# Altium schematic sheet Top.SchDoc: TRACE TRACK
size A4; Author: YZ
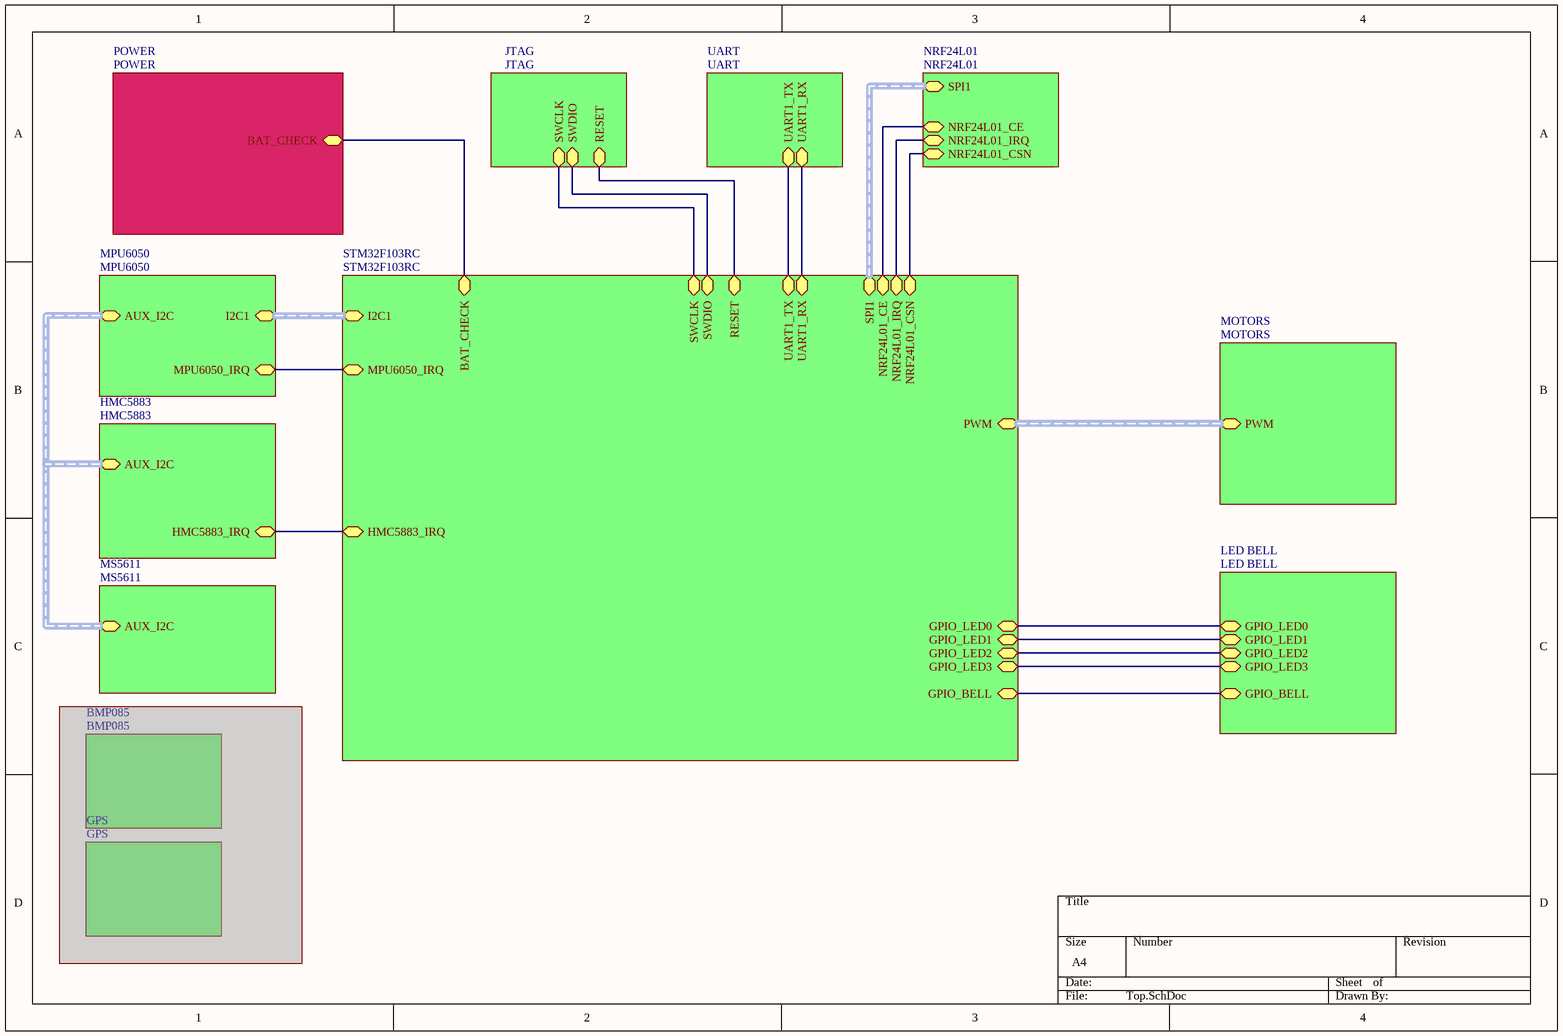
[diagram p0: Top.SchDoc]

## Sub-sheets
BMP085 = BMP085 (masked out): no entries
GPS = GPS (masked out): no entries
HMC5883 = HMC5883: AUX_I2C (harness AUX_I2C), HMC5883_IRQ
JTAG = JTAG: SWCLK, SWDIO, RESET
LED BELL = LED BELL: GPIO_LED1, GPIO_LED0, GPIO_BELL, GPIO_LED3, GPIO_LED2
MOTORS = MOTORS: PWM (harness PWM)
MPU6050 = MPU6050: MPU6050_IRQ, I2C1 (harness I2C1), AUX_I2C (harness AUX_I2C)
MS5611 = MS5611: AUX_I2C (harness AUX_I2C)
NRF24L01 = NRF24L01: SPI1 (harness SPI1), NRF24L01_IRQ, NRF24L01_CSN, NRF24L01_CE
POWER = POWER: BAT_CHECK
STM32F103RC = STM32F103RC: UART1_TX, UART1_RX, SWCLK, RESET, SWDIO, GPIO_BELL, GPIO_LED0, GPIO_LED1, PWM (harness PWM), NRF24L01_IRQ, NRF24L01_CSN, SPI1 (harness SPI1), NRF24L01_CE, I2C1 (harness I2C1), MPU6050_IRQ, HMC5883_IRQ, BAT_CHECK, GPIO_LED2, GPIO_LED3
UART = UART: UART1_TX, UART1_RX

## Nets
(unnamed): sheet POWER/BAT_CHECK, sheet STM32F103RC/BAT_CHECK
(unnamed): sheet JTAG/SWCLK, sheet STM32F103RC/SWCLK
(unnamed): sheet JTAG/SWDIO, sheet STM32F103RC/SWDIO
(unnamed): sheet JTAG/RESET, sheet STM32F103RC/RESET
(unnamed): sheet UART/UART1_TX, sheet STM32F103RC/UART1_TX
(unnamed): sheet UART/UART1_RX, sheet STM32F103RC/UART1_RX
(unnamed): sheet NRF24L01/NRF24L01_IRQ, sheet STM32F103RC/NRF24L01_IRQ
(unnamed): sheet NRF24L01/NRF24L01_CSN, sheet STM32F103RC/NRF24L01_CSN
(unnamed): sheet NRF24L01/NRF24L01_CE, sheet STM32F103RC/NRF24L01_CE
(unnamed): sheet LED BELL/GPIO_LED1, sheet STM32F103RC/GPIO_LED1
(unnamed): sheet LED BELL/GPIO_LED0, sheet STM32F103RC/GPIO_LED0
(unnamed): sheet LED BELL/GPIO_BELL, sheet STM32F103RC/GPIO_BELL
(unnamed): sheet LED BELL/GPIO_LED3, sheet STM32F103RC/GPIO_LED3
(unnamed): sheet LED BELL/GPIO_LED2, sheet STM32F103RC/GPIO_LED2
(unnamed): sheet MPU6050/MPU6050_IRQ, sheet STM32F103RC/MPU6050_IRQ
(unnamed): sheet STM32F103RC/HMC5883_IRQ, sheet HMC5883/HMC5883_IRQ

## Buses and harness runs
harness sheet HMC5883/AUX_I2C = sheet MPU6050/AUX_I2C = sheet MS5611/AUX_I2C
harness sheet MOTORS/PWM = sheet STM32F103RC/PWM
harness sheet MPU6050/I2C1 = sheet STM32F103RC/I2C1
harness sheet NRF24L01/SPI1 = sheet STM32F103RC/SPI1